# EAGLE design rc2014_ADS1220 (EAGLE 7.6.0)
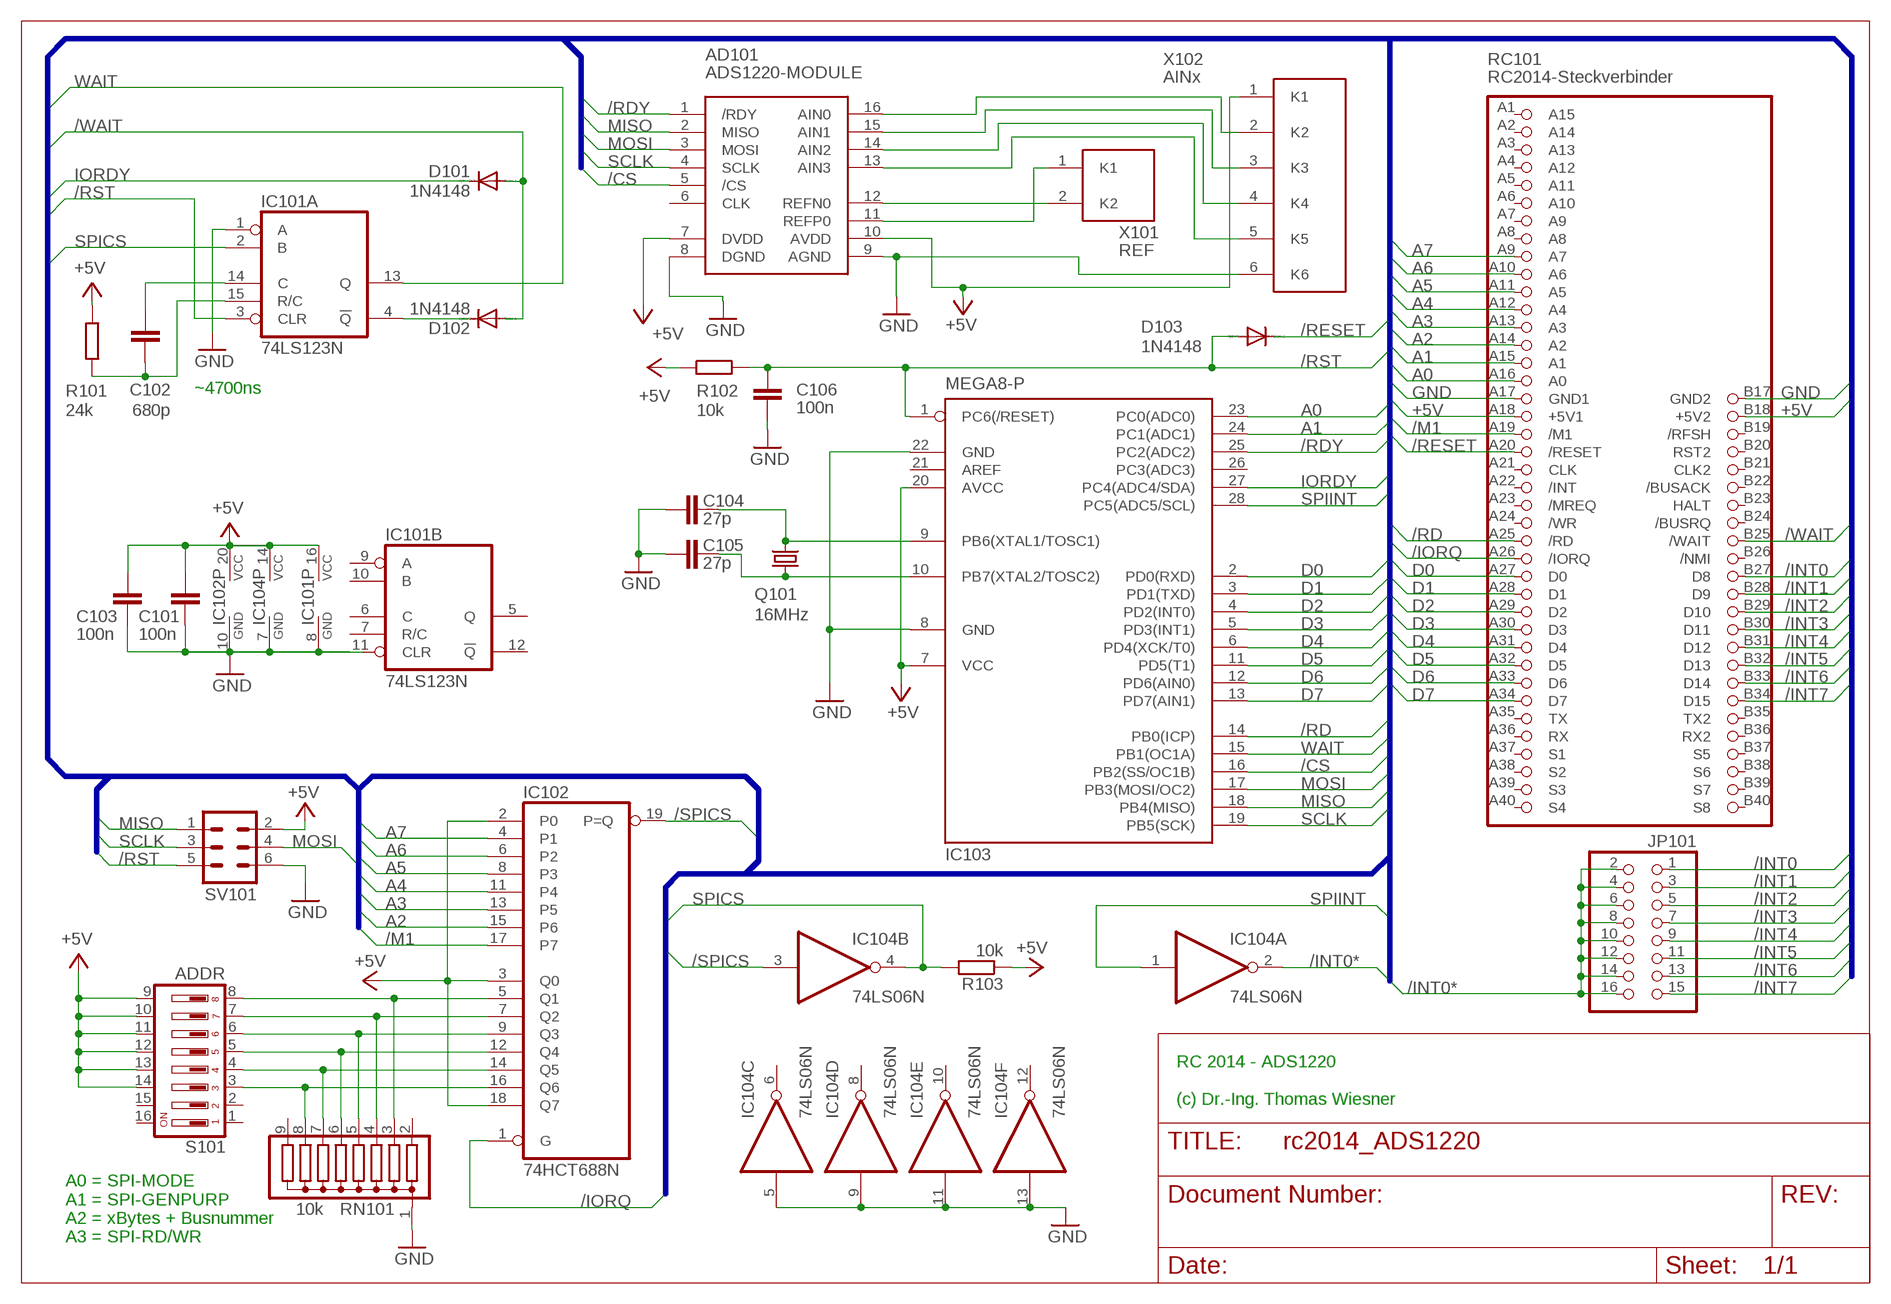
[diagram p0: schematic, sheet 1]

## Parts
AD101  ADS1220-MODULE  [ADS1220-MOD]
C101  100n  C-EU025-025X050  [C025-025X050]
C102  680p  C-EU025-025X050  [C025-025X050]
C103  100n  C-EU025-025X050  [C025-025X050]
C104  27p  C-EU025-025X050  [C025-025X050]
C105  27p  C-EU025-025X050  [C025-025X050]
C106  100n  C-EU025-025X050  [C025-025X050]
D101  1N4148  1N4148DO35-10  [DO35-10]
D102  1N4148  1N4148DO35-10  [DO35-10]
D103  1N4148  1N4148DO35-10  [DO35-10]
IC101  74LS123N  [DIL16]
IC102  74HCT688N  [DIL20]
IC103  MEGA8-P  [DIL28-3]
IC104  74LS06N  [DIL14]
JP101  PINHD-2X8  [2X08]
Q101  16MHz  CRYSTALHC49U-V  [HC49U-V]
R101  24k  R-EU_0207/10  [0207/10]
R102  10k  R-EU_0207/10  [0207/10]
R103  10k  R-EU_0207/10  [0207/10]
RC101  RC2014-Steckverbinder  RC2014STECKER  [RC2014-STECKER]
RN101  10k  G08R  [SIL9]
S101  ADDR  DS08  [DS-08]
SV101  ML6L  [ML6L]
X101  REF  AKL182-2  [AKL182-2]
X102  AINx  AKL182-6  [AKL182-6]

## Nets
+5V: AD101.7(DVDD) AD101.10(AVDD) C101.2 C103.2 IC101.16(P:VCC) IC102.2(P0) IC102.3(Q0) IC102.18(Q7) IC102.20(VCC) IC103.7(VCC) IC103.20(AVCC) IC104.14(P:VCC) R101.1 R102.1 R103.1 RC101.A18(+5V1) RC101.B18(+5V2) S101.9 S101.10 S101.11 S101.12 S101.13 S101.14 SV101.2 X102.1(K1)
/CS: AD101.5(/CS) IC103.16(PB2(SS/OC1B))
/INT0: JP101.1 RC101.B27(D8)
/INT0*: IC104.2(A:O) JP101.2 JP101.4 JP101.6 JP101.8 JP101.10 JP101.12 JP101.14 JP101.16
/INT1: JP101.3 RC101.B28(D9)
/INT2: JP101.5 RC101.B29(D10)
/INT3: JP101.7 RC101.B30(D11)
/INT4: JP101.9 RC101.B31(D12)
/INT5: JP101.11 RC101.B32(D13)
/INT6: JP101.13 RC101.B33(D14)
/INT7: JP101.15 RC101.B34(D15)
/IORQ: IC102.1(G) RC101.A26(/IORQ)
/M1: IC102.17(P7) RC101.A19(/M1)
/RD: IC103.14(PB0(ICP)) RC101.A25(/RD)
/RDY: AD101.1(/RDY) IC103.25(PC2(ADC2))
/RESET: D103.C RC101.A20(/RESET)
/RST: C106.2 D103.A IC101.3(A:CLR) IC103.1(PC6(/RESET)) R102.2 SV101.5
/SPICS: IC102.19(P=Q) IC104.3(B:I)
/WAIT: D101.A D102.A RC101.B25(/WAIT)
A0: IC103.23(PC0(ADC0)) RC101.A16(A0)
A1: IC103.24(PC1(ADC1)) RC101.A15(A1)
A2: IC102.15(P6) RC101.A14(A2)
A3: IC102.13(P5) RC101.A13(A3)
A4: IC102.11(P4) RC101.A12(A4)
A5: IC102.8(P3) RC101.A11(A5)
A6: IC102.6(P2) RC101.A10(A6)
A7: IC102.4(P1) RC101.A9(A7)
D0: IC103.2(PD0(RXD)) RC101.A27(D0)
D1: IC103.3(PD1(TXD)) RC101.A28(D1)
D2: IC103.4(PD2(INT0)) RC101.A29(D2)
D3: IC103.5(PD3(INT1)) RC101.A30(D3)
D4: IC103.6(PD4(XCK/T0)) RC101.A31(D4)
D5: IC103.11(PD5(T1)) RC101.A32(D5)
D6: IC103.12(PD6(AIN0)) RC101.A33(D6)
D7: IC103.13(PD7(AIN1)) RC101.A34(D7)
GND: AD101.8(DGND) AD101.9(AGND) C101.1 C103.1 C104.2 C105.2 C106.1 IC101.1(A:A) IC101.8(P:GND) IC101.11(B:CLR) IC102.10(GND) IC103.8(GND) IC103.22(GND) IC104.5(C:I) IC104.7(P:GND) IC104.9(D:I) IC104.11(E:I) IC104.13(F:I) RC101.A17(GND1) RC101.B17(GND2) RN101.1 SV101.6 X102.6(K6)
IORDY: D101.C IC103.27(PC4(ADC4/SDA))
MISO: AD101.2(MISO) IC103.18(PB4(MISO)) SV101.1
MOSI: AD101.3(MOSI) IC103.17(PB3(MOSI/OC2)) SV101.4
N$1: C102.1 IC101.15(A:R/C) R101.2
N$2: D102.C IC101.4(A:!Q)
N$3: C105.1 IC103.10(PB7(XTAL2/TOSC2)) Q101.1
N$4: C102.2 IC101.14(A:C)
N$5: C104.1 IC103.9(PB6(XTAL1/TOSC1)) Q101.2
N$6: IC102.16(Q6) RN101.8 S101.3
N$7: IC102.14(Q5) RN101.7 S101.4
N$8: IC102.12(Q4) RN101.6 S101.5
N$9: IC102.9(Q3) RN101.5 S101.6
N$10: IC102.7(Q2) RN101.4 S101.7
N$11: IC102.5(Q1) RN101.3 S101.8
N$12: AD101.16(AIN0) X102.2(K2)
N$13: AD101.15(AIN1) X102.3(K3)
N$14: AD101.14(AIN2) X102.4(K4)
N$15: AD101.13(AIN3) X102.5(K5)
N$16: AD101.11(REFP0) X101.1(K1)
N$17: AD101.12(REFN0) X101.2(K2)
SCLK: AD101.4(SCLK) IC103.19(PB5(SCK)) SV101.3
SPICS: IC101.2(A:B) IC104.4(B:O) R103.2
SPIINT: IC103.28(PC5(ADC5/SCL)) IC104.1(A:I)
WAIT: IC101.13(A:Q) IC103.15(PB1(OC1A))
Unconnected: AD101.6(CLK) IC101.5(B:Q) IC101.6(B:C) IC101.7(B:R/C) IC101.9(B:A) IC101.10(B:B) IC101.12(B:!Q) IC103.21(AREF) IC103.26(PC3(ADC3)) IC104.6(C:O) IC104.8(D:O) IC104.10(E:O) IC104.12(F:O) RC101.A1(A15) RC101.A2(A14) RC101.A3(A13) RC101.A4(A12) RC101.A5(A11) RC101.A6(A10) RC101.A7(A9) RC101.A8 RC101.A21(CLK) RC101.A22(/INT) RC101.A23(/MREQ) RC101.A24(/WR) RC101.A35(TX) RC101.A36(RX) RC101.A37(S1) RC101.A38(S2) RC101.A39(S3) RC101.A40(S4) RC101.B19(/RFSH) RC101.B20(RST2) RC101.B21(CLK2) RC101.B22(/BUSACK) RC101.B23(HALT) RC101.B24(/BUSRQ) RC101.B26(/NMI) RC101.B35(TX2) RC101.B36(RX2) RC101.B37(S5) RC101.B38(S6) RC101.B39(S7) RC101.B40(S8) RN101.2 RN101.9 S101.1 S101.2 S101.15 S101.16

## Buses
B$1
B$2

## Notes on the sheet
- ~4700ns
- RC 2014 - ADS1220
  
  (c) Dr.-Ing. Thomas Wiesner
- A0 = SPI-MODE
  A1 = SPI-GENPURP
  A2 = xBytes + Busnummer
  A3 = SPI-RD/WR

## Library data of the parts
AD101 = mbc:ADS1220-MODULE: ADS1220-Module, z.B. von Amazon
C101-C106 = rcl:C-EU: CAPACITOR, European symbol
D101-D103 = diode:1N4148: DIODE high speed (Philips)
IC101 = 74xx-eu:74*123: Retriggerable monostable MULTIVIBRATOR
IC102 = 74xx-eu:74*688: 8-bit MAGNITUDE/IDENTITY COMPARATOR, totem pole
IC103 = atmel:MEGA8-P: MICROCONTROLLER 8 Kbytes FLASH, 1 kbytes SRAM, 512 bytes EEPROM, USART, 4-channel 10 bit ADC, 2-channel 8 bit ADC Pin compatible with Atmega48, ATMega88, ATMega168 Source: avr.lbr; OC_FARNELL: unknown; OC_NEWARK: unknown
IC104 = 74xx-eu:74*06: Hex INVERTER, open collector high-voltage output
JP101 = pinhead:PINHD-2X8: PIN HEADER
Q101 = crystal:CRYSTAL: CRYSTAL; OC_FARNELL: 1666969; OC_NEWARK: unknown
R101-R103 = resistor:R-EU_: RESISTOR, European symbol
RC101 = mbc:RC2014: RC-2014-Steckverbinder Modul
RN101 = resistor-sil:G08R: SIL RESISTOR; OC_FARNELL: unknown; OC_NEWARK: unknown
S101 = switch-dil:DS08: DIL/CODE SWITCH; MPN: DS08; OC_FARNELL: unknown; OC_NEWARK: 73J0071
SV101 = con-ml:ML6L: HARTING; OC_FARNELL: unknown; OC_NEWARK: unknown
X101 = mbc:AKL182-2: Steckverbinder Rastermaß: 3,5 mm Hersteller: RIA Reichelt: Bestellnummer AKL 182-02
X102 = mbc:AKL182-6: Steckverbinder Rastermaß: 3,5 mm Hersteller: RIA Reichelt: Bestellnummer AKL 182-06

## Board
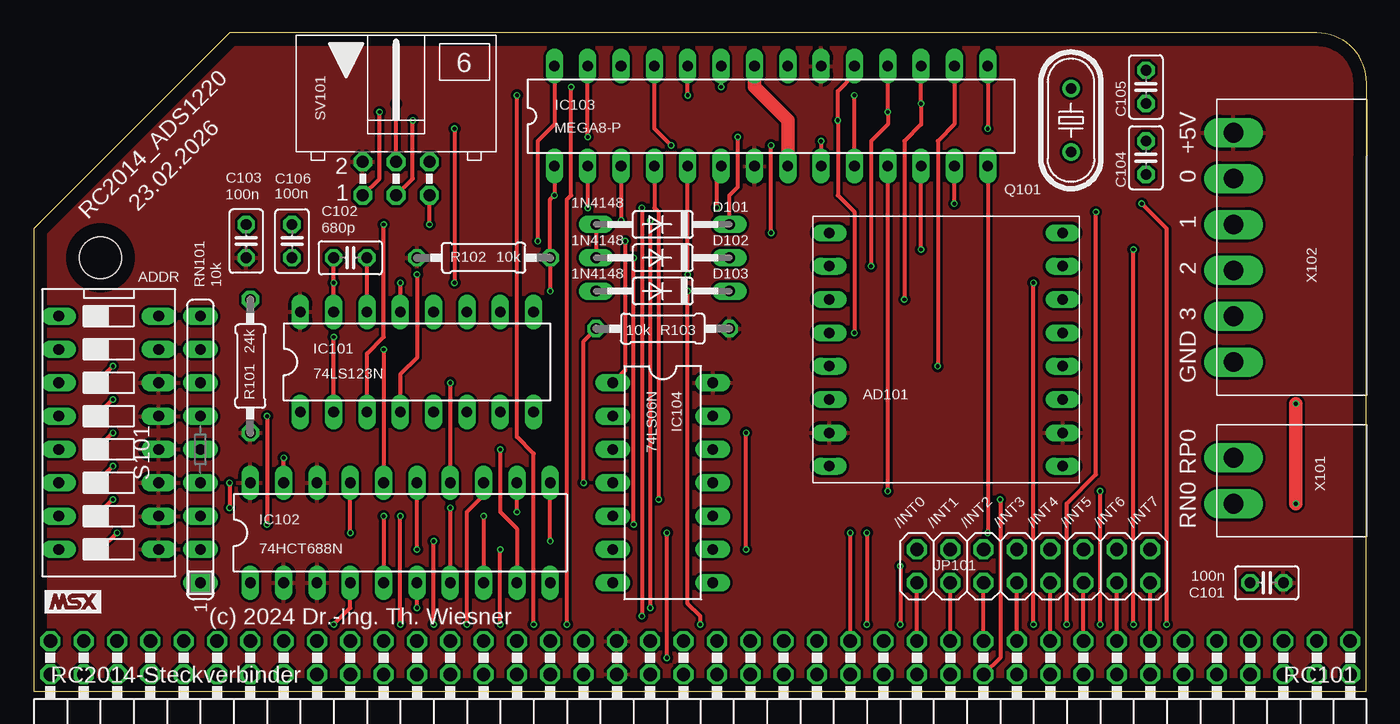
[diagram p1: board, top side]
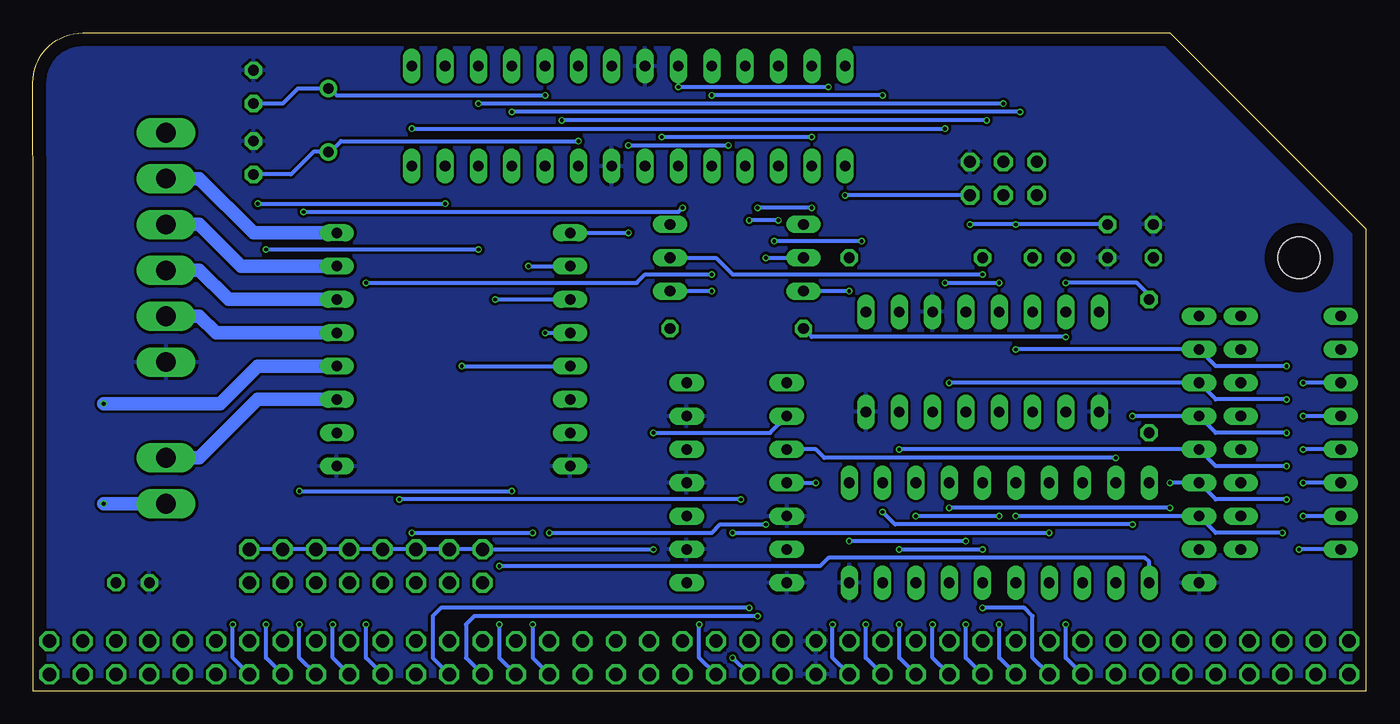
[diagram p2: board, bottom side, seen from below]

Size 101.6 x 50.16 mm. Coordinates in mm from the lower left corner, seen from the top.
Copper layers (1*16): Top 0.035mm / dielectric 1.5mm / Bottom 0.035mm
Design rules "default *": minimum track width 10mil, minimum drill 0.3mm, track to track 8mil, track to pad 4mil, pad to pad 8mil, via to via 8mil, smd to smd 8mil, copper to edge 40mil, drill to drill 8mil, minimum pad ring 10mil, minimum via ring 4mil, stop-mask expansion 4mil, vias tented up to drill 0mil, thermal gap 10mil

### Footprints (pad centres in the part's own frame; a part is rotated, then mirrored left to right if it is on the bottom)
ADS1220-MOD = drill 0.8 long: 1 -8.89,8.89; 2 -8.89,6.35; 3 -8.89,3.81; 4 -8.89,1.27; 5 -8.89,-1.27; 6 -8.89,-3.81; 7 -8.89,-6.35; 8 -8.89,-8.89; 9 8.89,-8.89; 10 8.89,-6.35; 11 8.89,-3.81; 12 8.89,-1.27; 13 8.89,1.27; 14 8.89,3.81; 15 8.89,6.35; 16 8.89,8.89
C025-025X050 = drill 0.813 octagon: 1 -1.27,0; 2 1.27,0
DO35-10 = drill 0.813 long: A 5.08,0; C -5.08,0
DIL16 = drill 0.813 long: 1 -8.89,-3.81; 2 -6.35,-3.81; 3 -3.81,-3.81; 4 -1.27,-3.81; 5 1.27,-3.81; 6 3.81,-3.81; 7 6.35,-3.81; 8 8.89,-3.81; 9 8.89,3.81; 10 6.35,3.81; 11 3.81,3.81; 12 1.27,3.81; 13 -1.27,3.81; 14 -3.81,3.81; 15 -6.35,3.81; 16 -8.89,3.81
DIL20 = drill 0.813 long: 1 -11.43,-3.81; 2 -8.89,-3.81; 3 -6.35,-3.81; 4 -3.81,-3.81; 5 -1.27,-3.81; 6 1.27,-3.81; 7 3.81,-3.81; 8 6.35,-3.81; 9 8.89,-3.81; 10 11.43,-3.81; 11 11.43,3.81; 12 8.89,3.81; 13 6.35,3.81; 14 3.81,3.81; 15 1.27,3.81; 16 -1.27,3.81; 17 -3.81,3.81; 18 -6.35,3.81; 19 -8.89,3.81; 20 -11.43,3.81
DIL28-3 = drill 0.813 long: 1 -16.51,-3.81; 2 -13.97,-3.81; 3 -11.43,-3.81; 4 -8.89,-3.81; 5 -6.35,-3.81; 6 -3.81,-3.81; 7 -1.27,-3.81; 8 1.27,-3.81; 9 3.81,-3.81; 10 6.35,-3.81; 11 8.89,-3.81; 12 11.43,-3.81; 13 13.97,-3.81; 14 16.51,-3.81; 15 16.51,3.81; 16 13.97,3.81; 17 11.43,3.81; 18 8.89,3.81; 19 6.35,3.81; 20 3.81,3.81; 21 1.27,3.81; 22 -1.27,3.81; 23 -3.81,3.81; 24 -6.35,3.81; 25 -8.89,3.81; 26 -11.43,3.81; 27 -13.97,3.81; 28 -16.51,3.81
DIL14 = drill 0.813 long: 1 -7.62,-3.81; 2 -5.08,-3.81; 3 -2.54,-3.81; 4 0,-3.81; 5 2.54,-3.81; 6 5.08,-3.81; 7 7.62,-3.81; 8 7.62,3.81; 9 5.08,3.81; 10 2.54,3.81; 11 0,3.81; 12 -2.54,3.81; 13 -5.08,3.81; 14 -7.62,3.81
2X08 = drill 1.016 octagon: 1 -8.89,-1.27; 2 -8.89,1.27; 3 -6.35,-1.27; 4 -6.35,1.27; 5 -3.81,-1.27; 6 -3.81,1.27; 7 -1.27,-1.27; 8 -1.27,1.27; 9 1.27,-1.27; 10 1.27,1.27; 11 3.81,-1.27; 12 3.81,1.27; 13 6.35,-1.27; 14 6.35,1.27; 15 8.89,-1.27; 16 8.89,1.27
HC49U-V = drill 0.813: 1 -2.413,0; 2 2.413,0
0207/10 = drill 0.813 octagon: 1 -5.08,0; 2 5.08,0
RC2014-STECKER = drill 1.016 octagon: A1 -49.53,1.27; A2 -46.99,1.27; A3 -44.45,1.27; A4 -41.91,1.27; A5 -39.37,1.27; A6 -36.83,1.27; A7 -34.29,1.27; A8 -31.75,1.27; A9 -29.21,1.27; A10 -26.67,1.27; A11 -24.13,1.27; A12 -21.59,1.27; A13 -19.05,1.27; A14 -16.51,1.27; A15 -13.97,1.27; A16 -11.43,1.27; A17 -8.89,1.27; A18 -6.35,1.27; A19 -3.81,1.27; A20 -1.27,1.27; A21 1.27,1.27; A22 3.81,1.27; A23 6.35,1.27; A24 8.89,1.27; A25 11.43,1.27; A26 13.97,1.27; A27 16.51,1.27; A28 19.05,1.27; A29 21.59,1.27; A30 24.13,1.27; A31 26.67,1.27; A32 29.21,1.27; A33 31.75,1.27; A34 34.29,1.27; A35 36.83,1.27; A36 39.37,1.27; A37 41.91,1.27; A38 44.45,1.27; A39 46.99,1.27; A40 49.53,1.27; B1 -49.53,3.81; B2 -46.99,3.81; B3 -44.45,3.81; B4 -41.91,3.81; B5 -39.37,3.81; B6 -36.83,3.81; B7 -34.29,3.81; B8 -31.75,3.81; B9 -29.21,3.81; B10 -26.67,3.81; B11 -24.13,3.81; B12 -21.59,3.81; B13 -19.05,3.81; B14 -16.51,3.81; B15 -13.97,3.81; B16 -11.43,3.81; B17 -8.89,3.81; B18 -6.35,3.81; B19 -3.81,3.81; B20 -1.27,3.81; B21 1.27,3.81; B22 3.81,3.81; B23 6.35,3.81; B24 8.89,3.81; B25 11.43,3.81; B26 13.97,3.81; B27 16.51,3.81; B28 19.05,3.81; B29 21.59,3.81; B30 24.13,3.81; B31 26.67,3.81; B32 29.21,3.81; B33 31.75,3.81; B34 34.29,3.81; B35 36.83,3.81; B36 39.37,3.81; B37 41.91,3.81; B38 44.45,3.81; B39 46.99,3.81; B40 49.53,3.81 | hole 3.2: -45.72,33.02
SIL9 = drill 0.813 long: 1 -10.16,0; 2 -7.62,0; 3 -5.08,0; 4 -2.54,0; 5 0,0; 6 2.54,0; 7 5.08,0; 8 7.62,0; 9 10.16,0
DS-08 = drill 0.813 long: 1 -8.89,-3.81; 2 -6.35,-3.81; 3 -3.81,-3.81; 4 -1.27,-3.81; 5 1.27,-3.81; 6 3.81,-3.81; 7 6.35,-3.81; 8 8.89,-3.81; 9 8.89,3.81; 10 6.35,3.81; 11 3.81,3.81; 12 1.27,3.81; 13 -1.27,3.81; 14 -3.81,3.81; 15 -6.35,3.81; 16 -8.89,3.81
ML6L = drill 0.914 octagon: 1 -2.54,-1.27; 2 -2.54,1.27; 3 0,-1.27; 4 0,1.27; 5 2.54,-1.27; 6 2.54,1.27
AKL182-2 = drill 1.5 pad 2.184 long: 1 0,1.587; 2 0,-1.913
AKL182-6 = drill 1.5 pad 2.184 long: 1 0,8.58; 2 0,5.08; 3 0,1.58; 4 0,-1.913; 5 0,-5.405; 6 0,-8.898

### Placement (x,y rotation side)
AD101  69.53,26.04 0 top
C101  93.98,8.26 0 top
C102  24.13,33.02 0 top
C103  16.19,34.29 270 top
C104  84.77,40.64 90 top
C105  84.77,46.04 90 top
C106  19.68,34.29 90 top
D101  47.94,35.56 180 top
D102  47.94,33.02 180 top
D103  47.94,30.48 180 top
IC101  29.21,25.08 0 top
IC102  27.94,12.06 0 top
IC103  56.2,43.81 0 top
IC104  47.94,15.88 270 top
JP101  76.2,9.53 0 top
Q101  79.06,43.5 270 top
R101  16.51,24.77 90 top
R102  34.29,33.02 0 top
R103  47.94,27.62 180 top
RC101  50.8,0 0 top
RN101  12.7,18.41 90 top
S101  5.71,19.68 270 top
SV101  27.62,39.05 0 top
X101  91.44,16.19 0 top
X102  91.44,33.97 0 top

### Tracks (layer width: path | path; a pad name or v marks a point on that pad's centre or on a via)
+5V
  pour Top: 0,35.24 14.92,50.16 101.6,50.16 101.6,0 0,0
/CS  (via drill 0.3)
  Top 0.305: IC103.16 70.17,43.18 68.9,41.91 v68.9,24.77
  Bottom 0.305: v68.9,24.77 AD101.5
/INT0
  Top 0.305: RC101.B27 JP101.1
/INT0*  (via drill 0.3)
  Top 0.305: v54.29,10.79 v54.29,19.68
  Bottom 0.305: JP101.16 JP101.14 JP101.12 JP101.10 JP101.8 JP101.6 JP101.4 JP101.2 v54.29,10.79 | v54.29,19.68 45.4,19.68 IC104.2
/INT1
  Top 0.305: RC101.B28 JP101.3
/INT2
  Top 0.305: RC101.B29 JP101.5
/INT3
  Top 0.305: RC101.B30 JP101.7
/INT4
  Top 0.305: RC101.B31 JP101.9
/INT5
  Top 0.305: RC101.B32 JP101.11
/INT6
  Top 0.305: RC101.B33 JP101.13
/INT7
  Top 0.305: RC101.B34 JP101.15
/IORQ  (via drill 0.3)
  Top 0.305: v66.04,9.53 v66.04,5.08
  Bottom 0.305: IC102.1 16.51,9.84 16.83,10.16 40.96,10.16 41.59,9.53 v66.04,9.53 | v66.04,5.08 66.04,2.54 RC101.A26
/M1  (via drill 0.3)
  Top 0.305: v48.26,2.54 v48.26,12.06 | v24.13,12.06 IC102.17
  Bottom 0.305: RC101.A19 v48.26,2.54 | v48.26,12.06 v24.13,12.06
/RD  (via drill 0.3)
  Top 0.305: IC103.14 v72.71,12.06 | v63.5,12.06 v63.5,5.08
  Bottom 0.305: v72.71,12.06 v63.5,12.06 | v63.5,5.08 63.5,2.54 RC101.A25
/RDY  (via drill 0.3)
  Top 0.305: v56.2,34.92 v56.2,41.59 | v48.58,41.59 47.31,42.86 IC103.25
  Bottom 0.305: AD101.1 v56.2,34.92 | v56.2,41.59 v48.58,41.59
/RESET  (via drill 0.3)
  Top 0.305: v50.8,5.08 50.8,5.71 49.85,6.67 v49.85,30.48
  Bottom 0.305: RC101.A20 50.8,2.54 v50.8,5.08 | v49.85,30.48 D103.C
/RST  (via drill 0.3)
  Top 0.305: v30.16,35.56 SV101.5 | IC103.1 v39.69,37.78 39.37,37.47 R102.2 v39.37,30.48 | IC101.3 25.4,25.72 26.67,26.99 v26.67,35.56
  Bottom 0.305: SV101.5 v39.69,37.78 | C106.2 v26.67,35.56 v30.16,35.56 | v39.37,30.48 D103.A
/SPICS  (via drill 0.3)
  Top 0.305: IC102.19 v19.05,17.78
  Bottom 0.305: v19.05,17.78 41.27,17.78 41.91,18.41 IC104.3
/WAIT  (via drill 0.3)
  Top 0.305: D101.A D102.A | RC101.B25 v62.23,12.06 | v45.72,12.7 v45.72,33.02
  Bottom 0.305: v62.23,12.06 49.85,12.06 49.21,12.7 v45.72,12.7 | v45.72,33.02 D102.A
A0  (via drill 0.3)
  Top 0.305: IC103.23 v52.39,46.04 | v40.64,5.08 40.64,37.47 40.96,37.78 v40.96,46.04
  Bottom 0.305: v52.39,46.04 v40.96,46.04 | RC101.A16 40.64,2.54 v40.64,5.08
A1  (via drill 0.3)
  Top 0.305: v38.1,5.08 38.1,18.1 36.83,19.37 v36.83,45.4 | v49.85,45.4 IC103.24
  Bottom 0.305: RC101.A15 38.1,2.54 v38.1,5.08 | v36.83,45.4 v49.85,45.4
A2  (via drill 0.3)
  Top 0.305: v35.56,5.08 v35.56,10.79 | v29.21,10.79 IC102.15
  Bottom 0.305: RC101.A14 35.56,2.54 v35.56,5.08 | v35.56,10.79 v29.21,10.79
A3  (via drill 0.3)
  Top 0.305: v33.02,5.08 33.02,13.65 34.29,14.92 IC102.13
  Bottom 0.305: RC101.A13 33.02,2.54 v33.02,5.08
A4  (via drill 0.3)
  Top 0.305: v30.48,5.08 v30.48,11.43 | v39.37,11.43 IC102.11
  Bottom 0.305: RC101.A12 30.48,2.54 v30.48,5.08 | v30.48,11.43 v39.37,11.43
A5  (via drill 0.3)
  Top 0.305: v27.94,5.08 v27.94,13.34 | v34.29,13.34 IC102.8
  Bottom 0.305: RC101.A11 27.94,2.54 v27.94,5.08 | v27.94,13.34 v34.29,13.34
A6  (via drill 0.3)
  Top 0.305: v29.21,6.35 IC102.6
  Bottom 0.305: RC101.A10 25.4,2.54 25.4,5.71 26.04,6.35 v29.21,6.35
A7  (via drill 0.3)
  Top 0.305: v22.86,5.08 24.13,6.35 IC102.4
  Bottom 0.305: RC101.A9 22.86,2.54 v22.86,5.08
D0  (via drill 0.3)
  Top 0.305: IC103.2 v42.23,36.83 | v46.35,36.83 v46.35,5.71
  Bottom 0.305: v42.23,36.83 v46.35,36.83 | v46.35,5.71 67.94,5.71 68.58,5.08 68.58,2.54 RC101.A27
D1  (via drill 0.3)
  Top 0.305: IC103.3 v44.77,35.88 | v46.99,35.88 v46.99,6.35
  Bottom 0.305: v44.77,35.88 v46.99,35.88 | v46.99,6.35 70.48,6.35 71.12,5.71 71.12,2.54 RC101.A28
D2  (via drill 0.3)
  Top 0.305: IC103.4 47.31,36.83 47.62,36.51 v47.62,14.61 | v73.66,14.61 73.66,2.54 RC101.A29
  Bottom 0.305: v47.62,14.61 v73.66,14.61
D3  (via drill 0.3)
  Top 0.305: v76.2,5.08 v76.2,31.11 | v49.85,31.75 IC103.5
  Bottom 0.305: RC101.A30 76.2,2.54 v76.2,5.08 | v76.2,31.11 55.56,31.11 54.93,31.75 v49.85,31.75
D4  (via drill 0.3)
  Top 0.305: v78.74,5.08 78.74,14.29 80.96,16.51 v80.96,36.51 | v52.07,36.83 52.07,39.05 52.39,39.37 IC103.6
  Bottom 0.305: RC101.A31 78.74,2.54 v78.74,5.08 | v80.96,36.51 52.39,36.51 v52.07,36.83
D5  (via drill 0.3)
  Top 0.305: v81.28,5.08 v81.28,15.24 | v65.09,15.24 IC103.11
  Bottom 0.305: RC101.A32 81.28,2.54 v81.28,5.08 | v81.28,15.24 v65.09,15.24
D6  (via drill 0.3)
  Top 0.305: v83.82,5.08 v83.82,33.66 | v67.63,33.66 IC103.12
  Bottom 0.305: RC101.A33 83.82,2.54 v83.82,5.08 | v83.82,33.66 v67.63,33.66
D7  (via drill 0.3)
  Top 0.305: v86.36,5.08 86.36,35.24 v84.45,37.15 | v70.17,37.15 IC103.13
  Bottom 0.305: RC101.A34 86.36,2.54 v86.36,5.08 | v84.45,37.15 v70.17,37.15
GND
  Top 1.016: IC103.22 54.93,46.04 57.47,43.5 IC103.8
  pour Bottom: 0,35.24 14.92,50.16 101.6,50.16 101.6,0 0,0
IORDY  (via drill 0.3)
  Top 0.305: D101.C 53.02,37.78 53.66,38.42 v53.66,42.23 | v42.23,42.23 IC103.27
  Bottom 0.305: v53.66,42.23 v42.23,42.23
MISO  (via drill 0.3)
  Top 0.305: SV101.1 26.35,39.05 v26.35,44.13 | IC103.18 v65.09,44.13 65.09,43.18 63.82,41.91 v63.82,32.38
  Bottom 0.305: v26.35,44.13 v65.09,44.13 | v63.82,32.38 AD101.2
MOSI  (via drill 0.3)
  Top 0.305: SV101.4 v27.62,44.77 | IC103.17 v67.63,44.77 67.63,43.18 66.36,41.91 v66.36,29.84
  Bottom 0.305: v27.62,44.77 v67.63,44.77 | v66.36,29.84 AD101.3
N$1  (via drill 0.3)
  Top 0.305: IC101.15 v22.86,31.11 C102.1
  Bottom 0.305: R101.2 16.51,30.16 17.46,31.11 v22.86,31.11
N$2  (via drill 0.3)
  Top 0.305: v29.21,31.75 29.21,25.4 27.94,24.13 IC101.4
  Bottom 0.305: D102.C 49.53,33.02 48.26,31.75 v29.21,31.75
N$3  (via drill 0.3)
  Top 0.305: IC103.10 v62.55,45.4
  Bottom 0.305: C105.1 82.55,44.77 81.41,45.91 Q101.1 78.93,45.91 78.42,45.4 v62.55,45.4
N$4
  Top 0.305: IC101.14 C102.2
N$5  (via drill 0.3)
  Top 0.305: v60.01,41.91 IC103.9
  Bottom 0.305: C104.1 81.92,39.37 80.2,41.08 Q101.2 78.93,41.08 78.11,41.91 v60.01,41.91
N$6  (via drill 0.3)
  Top 0.305: v4.76,23.5 v6.03,24.77 | v26.67,26.04 IC102.16
  Bottom 0.305: S101.3 v4.76,23.5 | v6.03,24.77 11.43,24.77 RN101.8 v26.67,26.04
N$7  (via drill 0.3)
  Top 0.305: v4.76,20.95 v6.03,22.23 | v31.75,23.5 IC102.14
  Bottom 0.305: S101.4 v4.76,20.95 | v6.03,22.23 11.43,22.23 RN101.7 v31.75,23.5
N$8  (via drill 0.3)
  Top 0.305: v4.76,18.41 v6.03,19.68 | v17.78,20.95 v17.78,12.7 | v36.83,13.65 IC102.12
  Bottom 0.305: S101.5 v4.76,18.41 | v6.03,19.68 11.43,19.68 RN101.6 v17.78,20.95 | v17.78,12.7 35.88,12.7 v36.83,13.65
N$9  (via drill 0.3)
  Top 0.305: v4.76,15.88 v6.03,17.14 | v35.56,18.41 35.56,13.65 36.83,12.38 IC102.9
  Bottom 0.305: S101.6 v4.76,15.88 | v6.03,17.14 11.43,17.14 RN101.5 v35.56,18.41
N$10  (via drill 0.3)
  Top 0.305: v4.76,13.34 v6.03,14.61 | v14.92,15.88 v14.92,13.97 | v31.75,13.97 IC102.7
  Bottom 0.305: S101.7 v4.76,13.34 | v6.03,14.61 11.43,14.61 RN101.4 v14.92,15.88 | v14.92,13.97 v31.75,13.97
N$11  (via drill 0.3)
  Top 0.305: v5.08,10.79 v6.35,12.06 | v26.67,13.34 IC102.5
  Bottom 0.305: S101.8 v5.08,10.79 | v6.35,12.06 11.43,12.06 RN101.3 v26.67,13.34
N$12
  Bottom 1.016: AD101.16 84.77,34.92 88.9,39.05 X102.2
N$13
  Bottom 0.305: X102.3
  Bottom 1.016: AD101.15 85.72,32.38 88.9,35.56 X102.3
N$14
  Bottom 0.305: X102.4
  Bottom 1.016: AD101.14 86.68,29.84 88.9,32.07 X102.4
N$15
  Bottom 0.305: X102.5
  Bottom 1.016: AD101.13 87.63,27.3 88.9,28.57 X102.5
N$16
  Bottom 1.016: AD101.11 84.45,22.23 88.9,17.78 X101.1
N$17  (via drill 0.3)
  Top 1.016: v96.2,21.91 v96.2,14.29
  Bottom 0.305: X101.2
  Bottom 1.016: AD101.12 84.45,24.77 87.31,21.91 v96.2,21.91 | v96.2,14.29 X101.2
SCLK  (via drill 0.3)
  Top 0.305: SV101.3 28.89,39.05 v28.89,43.5 | IC103.19 62.55,46.99 61.28,45.72 v61.28,43.5 61.28,37.78 62.55,36.51 v62.55,27.3
  Bottom 0.305: v28.89,43.5 v61.28,43.5 | v62.55,27.3 AD101.4
SPICS  (via drill 0.3)
  Top 0.305: IC101.2 v22.86,26.99 | v41.91,15.88 41.91,26.67 R103.2
  Bottom 0.305: v22.86,26.99 42.23,26.99 R103.2 | IC104.4 v41.91,15.88
SPIINT  (via drill 0.3)
  Top 0.305: IC103.28 39.69,43.18 38.42,41.91 v38.42,34.29 | v45.09,34.29 45.09,24.45 IC104.1
  Bottom 0.305: v38.42,34.29 v45.09,34.29
WAIT  (via drill 0.3)
  Top 0.305: IC103.15 v72.71,42.86 | v32.07,42.86 v32.07,31.11 | v27.94,31.11 IC101.13
  Bottom 0.305: v72.71,42.86 v32.07,42.86 | v32.07,31.11 v27.94,31.11

### Text on the board
tNames: +5V | 0 | 23.02.2026 | RC2014_ADS1220 | 1 | 2 | 3 | GND | RP0 | /INT0 | /INT1 | /INT2 | /INT3 | /INT4 | /INT5 | /INT6 | /INT7 | RN0 | (c) 2024 Dr.-Ing. Th. Wiesner